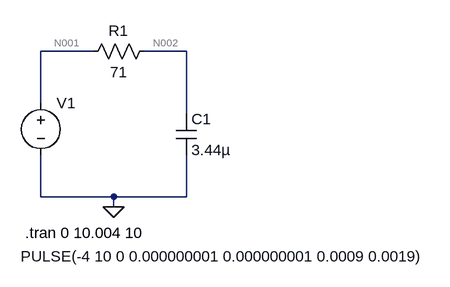
[diagram p0: schematic RC.asc]
RC.asc, the LTspice schematic file:
Version 4
SHEET 1 880 680
WIRE -32 -112 -112 -112
WIRE 112 -112 48 -112
WIRE -112 -32 -112 -112
WIRE 112 -16 112 -112
WIRE -112 112 -112 48
WIRE 0 112 -112 112
WIRE 112 112 112 48
WIRE 112 112 0 112
WIRE 0 128 0 112
FLAG 0 128 0
SYMBOL voltage -112 -48 R0
WINDOW 123 0 0 Left 0
WINDOW 39 0 0 Left 0
WINDOW 3 -31 252 Left 2
SYMATTR InstName V1
SYMATTR Value PULSE(-4 10 0 0.000000001 0.000000001 0.0009 0.0019)
SYMBOL cap 96 -16 R0
SYMATTR InstName C1
SYMATTR Value 3.44µ
SYMBOL res 64 -128 R90
WINDOW 0 0 56 VBottom 2
WINDOW 3 32 56 VTop 2
SYMATTR InstName R1
SYMATTR Value 71
TEXT -136 168 Left 2 !.tran 0 10.004 10

The netlist it stands for:
* RC.asc
V1 N001 0 PULSE(-4 10 0 0.000000001 0.000000001 0.0009 0.0019)
C1 N002 0 3.44µ
R1 N002 N001 71
.tran 0 10.004 10
.backanno
.end

* Results of the author's LTspice run, read from the files saved beside the schematic
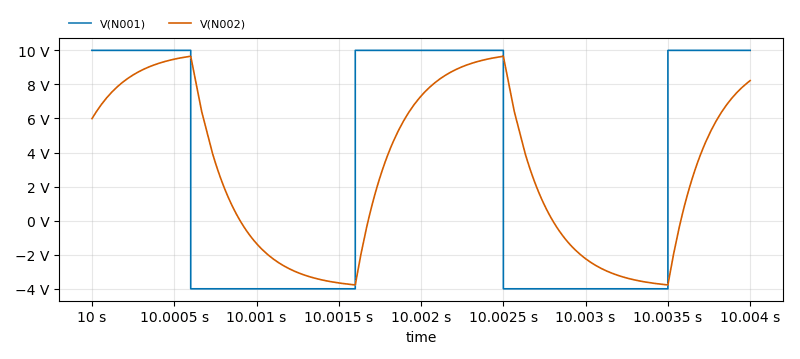
[diagram p1: Transient Analysis of RC.asc, plotted from the saved traces]
* Transient Analysis, 1 run:
*   V(N001): min -4 V, max 10 V, average 3 V, rms 7.616 V, last 10 V
*   V(N002): min -3.773 V, max 9.657 V, average 2.867 V, rms 5.734 V, last 8.223 V